# EAGLE design esquematico (EAGLE 8.0.2)
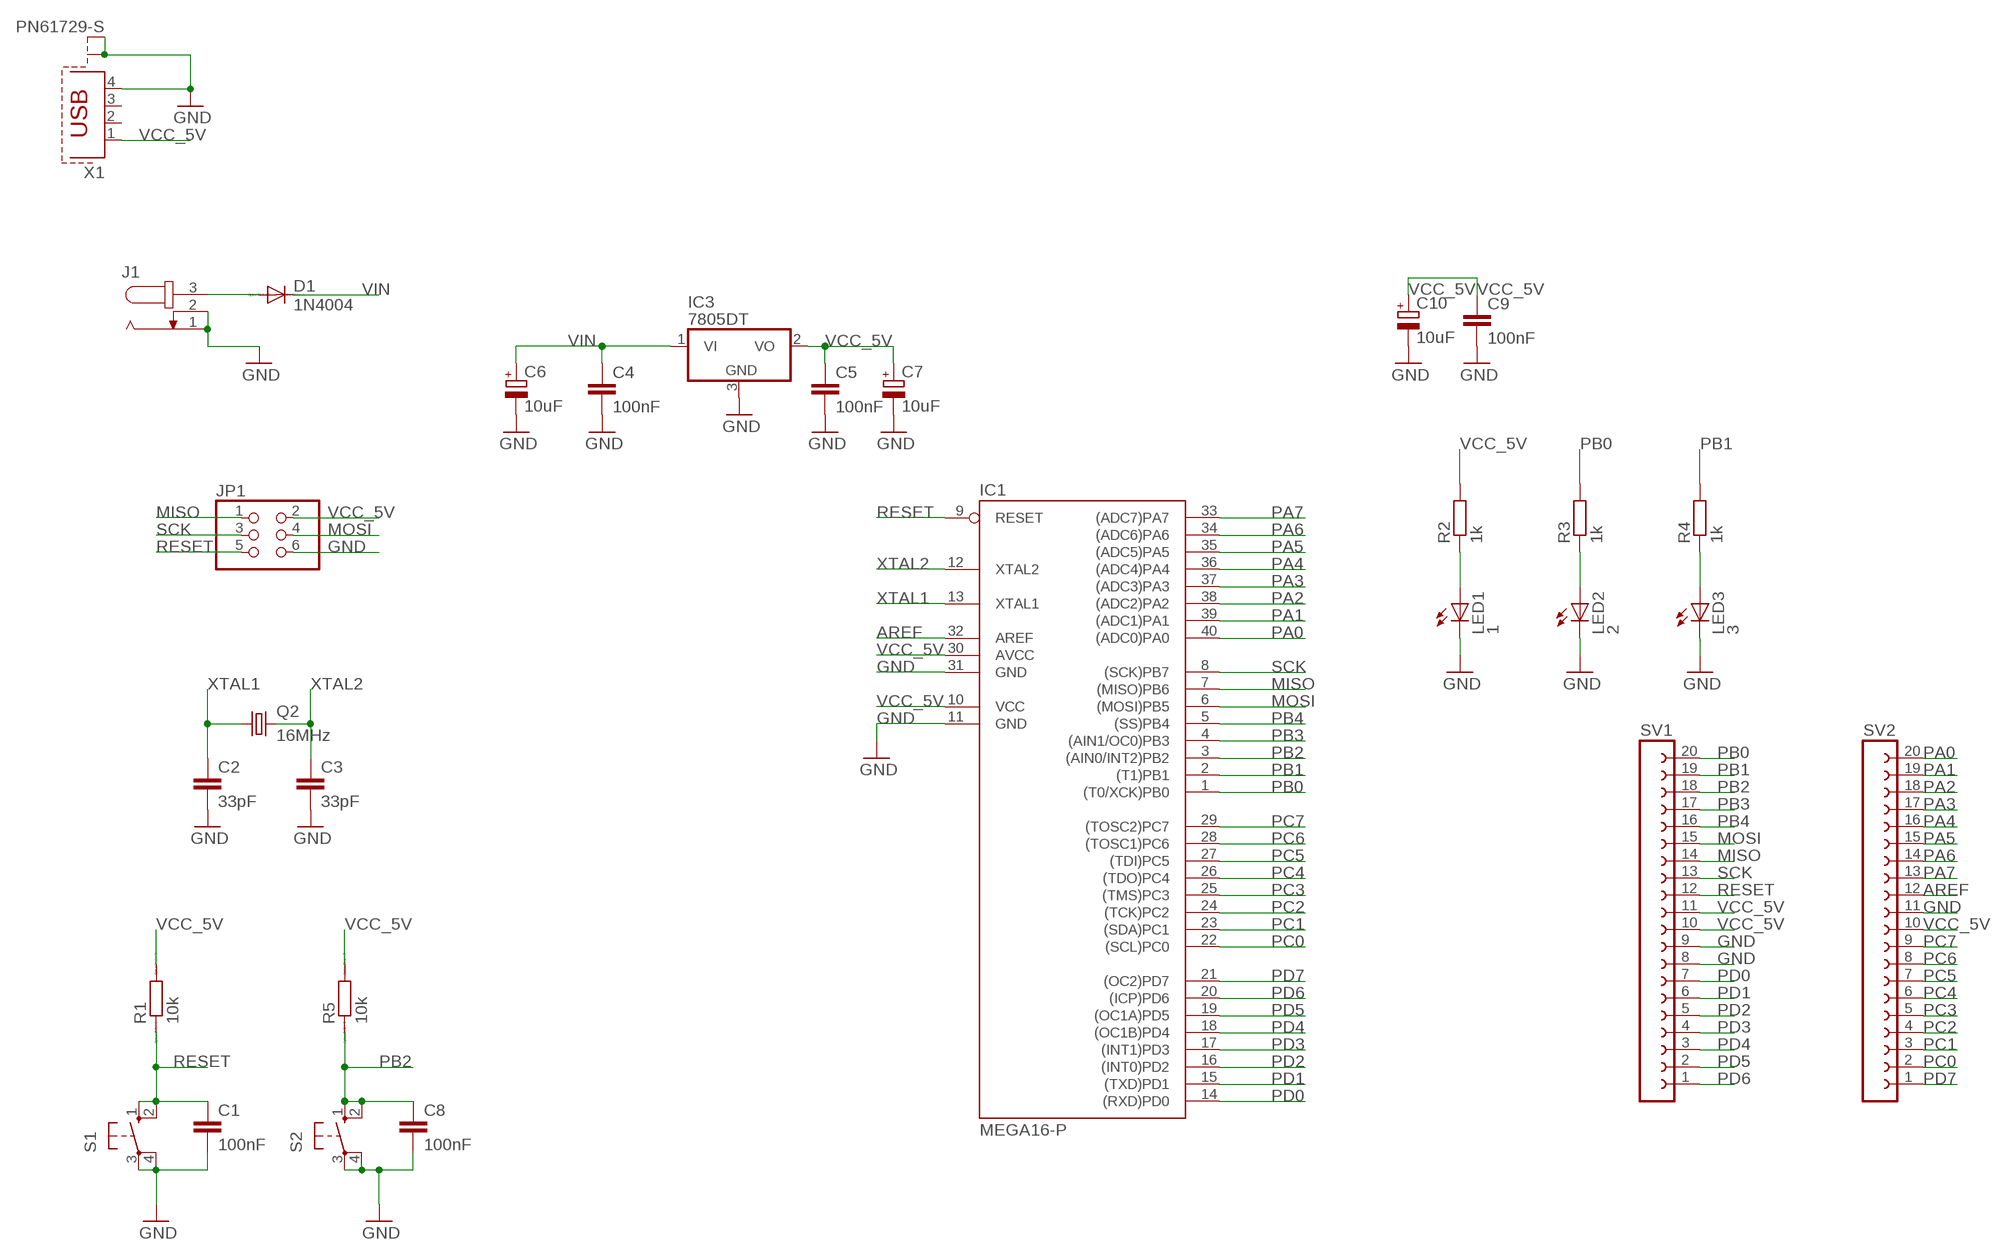
[diagram p0: schematic, sheet 1]

## Parts
C1  100nF  C-EUC1206  [C1206]
C2  33pF  C-EUC1206  [C1206]
C3  33pF  C-EUC1206  [C1206]
C4  100nF  C-EUC1206  [C1206]
C5  100nF  C-EUC1206  [C1206]
C6  10uF  CPOL-EUE2,5-6E  [E2,5-6E]
C7  10uF  CPOL-EUE2,5-6E  [E2,5-6E]
C8  100nF  C-EUC1206  [C1206]
C9  100nF  C-EUC1206  [C1206]
C10  10uF  CPOL-EUE2,5-6E  [E2,5-6E]
D1  1N4004  [DO41-10]
IC1  MEGA16-P  [DIL40]
IC3  7805DT  [TO252]
J1  JACK-PLUG1  [SPC4078]
JP1  PINHD-2X3  [2X03]
LED1  1  LED3MM  [LED3MM]
LED2  2  LED3MM  [LED3MM]
LED3  3  LED3MM  [LED3MM]
Q2  16MHz  CRYSTALHC49S  [HC49/S]
R1  10k  RR1206  [R1206]
R2  1k  R-EU_R1206  [R1206]
R3  1k  R-EU_R1206  [R1206]
R4  1k  R-EU_R1206  [R1206]
R5  10k  RR1206  [R1206]
S1  10-XX  [B3F-10XX]
S2  10-XX  [B3F-10XX]
SV1  FE20-1  [FE20]
SV2  FE20-1  [FE20]
X1  PN61729-S  [PN61729-S]

## Nets
AREF: IC1.32(AREF) SV2.12
GND: C1.2 C2.2 C3.2 C4.2 C5.2 C6.- C7.- C8.2 C9.2 C10.- IC1.11(GND) IC1.31(GND) IC3.3(GND) J1.1 J1.2 JP1.6 LED1.K(C) LED2.K(C) LED3.K(C) S1.3(P) S1.4(P1) S2.3(P) S2.4(P1) SV1.8 SV1.9 SV2.11 X1.4 X1.S1 X1.S2
MISO: IC1.7((MISO)PB6) JP1.1 SV1.14
MOSI: IC1.6((MOSI)PB5) JP1.4 SV1.15
N$1: LED1.A R2.1
N$2: LED2.A R3.1
N$3: LED3.A R4.1
N$6: D1.A J1.3
PA0: IC1.40((ADC0)PA0) SV2.20
PA1: IC1.39((ADC1)PA1) SV2.19
PA2: IC1.38((ADC2)PA2) SV2.18
PA3: IC1.37((ADC3)PA3) SV2.17
PA4: IC1.36((ADC4)PA4) SV2.16
PA5: IC1.35((ADC5)PA5) SV2.15
PA6: IC1.34((ADC6)PA6) SV2.14
PA7: IC1.33((ADC7)PA7) SV2.13
PB0: IC1.1((T0/XCK)PB0) R3.2 SV1.20
PB1: IC1.2((T1)PB1) R4.2 SV1.19
PB2: C8.1 IC1.3((AIN0/INT2)PB2) R5.1 S2.1(S) S2.2(S1) SV1.18
PB3: IC1.4((AIN1/OC0)PB3) SV1.17
PB4: IC1.5((SS)PB4) SV1.16
PC0: IC1.22((SCL)PC0) SV2.2
PC1: IC1.23((SDA)PC1) SV2.3
PC2: IC1.24((TCK)PC2) SV2.4
PC3: IC1.25((TMS)PC3) SV2.5
PC4: IC1.26((TDO)PC4) SV2.6
PC5: IC1.27((TDI)PC5) SV2.7
PC6: IC1.28((TOSC1)PC6) SV2.8
PC7: IC1.29((TOSC2)PC7) SV2.9
PD0: IC1.14((RXD)PD0) SV1.7
PD1: IC1.15((TXD)PD1) SV1.6
PD2: IC1.16((INT0)PD2) SV1.5
PD3: IC1.17((INT1)PD3) SV1.4
PD4: IC1.18((OC1B)PD4) SV1.3
PD5: IC1.19((OC1A)PD5) SV1.2
PD6: IC1.20((ICP)PD6) SV1.1
PD7: IC1.21((OC2)PD7) SV2.1
RESET: C1.1 IC1.9(RESET) JP1.5 R1.1 S1.1(S) S1.2(S1) SV1.12
SCK: IC1.8((SCK)PB7) JP1.3 SV1.13
VCC_5V: C5.1 C7.+ C9.1 C10.+ IC1.10(VCC) IC1.30(AVCC) IC3.2(VO) JP1.2 R1.2 R2.2 R5.2 SV1.10 SV1.11 SV2.10 X1.1
VIN: C4.1 C6.+ D1.C IC3.1(VI)
XTAL1: C2.1 IC1.13(XTAL1) Q2.1
XTAL2: C3.1 IC1.12(XTAL2) Q2.2
Unconnected: X1.2 X1.3

## Library data of the parts
C1 C4 C5 C8 C9 = rcl:C-EU: CAPACITOR, European symbol
C2 C3 = resistor:C-EU: CAPACITOR, European symbol
C6 C7 C10 = rcl:CPOL-EU: POLARIZED CAPACITOR, European symbol
D1 = diode:1N4004: DIODE general purpose rectifier, 1 A
IC1 = atmel:MEGA16-P: MICROCONTROLLER 16 Kbytes FLASH 1 kbytes SRAM 512 bytes EEPROM USART 8-channel 10 bit ADC Source: avr.lbr; MPN: ATMEGA16-16PU; OC_FARNELL: 9171142; OC_NEWARK: 01M6885
IC3 = linear:78*: Positive VOLTAGE REGULATOR Source: http://cache.national.com/ds/LM/LM78L05.pdf http://www.fairchildsemi.com/ds/LM/LM7805.pdf
J1 = con-jack:JACK-PLUG: DC POWER JACK Power Jack, DC, Right Angle, Through Hole, Rated 5A at 16VDC, PC Terminals Distributor: Farnell (www.Farnell.de) Drawing: 84N1161.pdf / 84N1162.pdf Manufacturer: SPC Technology (www.spctechnology.com) Type: SPC4077 / SPC 4078; OC_FARNELL: unknown; OC_NEWARK: unknown
JP1 = pinhead:PINHD-2X3: PIN HEADER
LED1-LED3 = led:LED: LED OSRAM: - CHIPLED LG R971, LG N971, LY N971, LG Q971, LY Q971, LO R971, LY R971 LH N974, LH R974 LS Q976, LO Q976, LY Q976 LO Q996 - Hyper CHIPLED LW Q18S LB Q993, LB Q99A, LB R99A - SideLED LS A670, LO A670, LY A670, LG A670, LP A670 LB A673, LV A673, LT A673, LW A673 LH A674 LY A675 LS A676, LA A676, LO A676, LY A676, LW A676 LS A679, LY A679, LG A679 - Hyper Micro SIDELED® LS Y876, LA Y876, LO Y876, LY Y876 LT Y87S - SmartLED LW L88C, LW L88S LB L89C, LB L89S, LG L890 LS L89K, LO L89K, LY L89K LS L896, LA L896, LO L896, LY L896 - TOPLED LS T670, LO T670, LY T670, LG T670, LP T670 LSG T670, LSP T670, LSY T670, LOP T670, LYG T670 LG T671, LOG T671, LSG T671 LB T673, LV T673, LT T673, LW T673 LH T674 LS T676, LA T676, LO T676, LY T676, LB T676, LH T676, LSB T676, LW T676 LB T67C, LV T67C, LT T67C, LS T67K, LO T67K, LY T67K, LW E67C LS E67B, LA E67B, LO E67B, LY E67B, LB E67C, LV E67C, LT E67C LW T67C LS T679, LY T679, LG T679 LS T770, LO T770, LY T770, LG T770, LP T770 LB T773, LV T773, LT T773, LW T773 LH T774 LS E675, LA E675, LY E675, LS T675 LS T776, LA T776, LO T776, LY T776, LB T776 LHGB T686 LT T68C, LB T68C - Hyper Mini TOPLED® LB M676 - Mini TOPLED Santana® LG M470 LS M47K, LO M47K, LY M47K Source: http://www.osram.convergy.de LUXEON: - LUMILED® LXK2-PW12-R00, LXK2-PW12-S00, LXK2-PW14-U00, LXK2-PW14-V00 LXK2-PM12-R00, LXK2-PM12-S00, LXK2-PM14-U00 LXK2-PE12-Q00, LXK2-PE12-R00, LXK2-PE12-S00, LXK2-PE14-T00, LXK2-PE14-U00 LXK2-PB12-K00, LXK2-PB12-L00, LXK2-PB12-M00, LXK2-PB14-N00, LXK2-PB14-P00, LXK2-PB14-Q00 LXK2-PR12-L00, LXK2-PR12-M00, LXK2-PR14-Q00, LXK2-PR14-R00 LXK2-PD12-Q00, LXK2-PD12-R00, LXK2-PD12-S00 LXK2-PH12-R00, LXK2-PH12-S00 LXK2-PL12-P00, LXK2-PL12-Q00, LXK2-PL12-R00 Source: www.luxeon.com KINGBRIGHT: KA-3528ASYC Source: www.kingbright.com
Q2 = crystal:CRYSTAL: CRYSTAL; OC_FARNELL: 1667008; OC_NEWARK: unknown
R1 R5 = eagle-ltspice:R: RESISTOR, European symbol; SPICEMODEL: NONE; SPICEPREFIX: R
R2-R4 = rcl:R-EU_: RESISTOR, European symbol
S1 S2 = switch-omron:10-XX: OMRON SWITCH; MPN: B3F-1000; OC_FARNELL: 176432; OC_NEWARK: 36M3542
SV1 SV2 = con-lsta:FE20-1: FEMALE HEADER; OC_FARNELL: unknown; OC_NEWARK: unknown
X1 = con-berg:PN61729-S: BERG USB connector; OC_FARNELL: unknown; OC_NEWARK: unknown

## Board
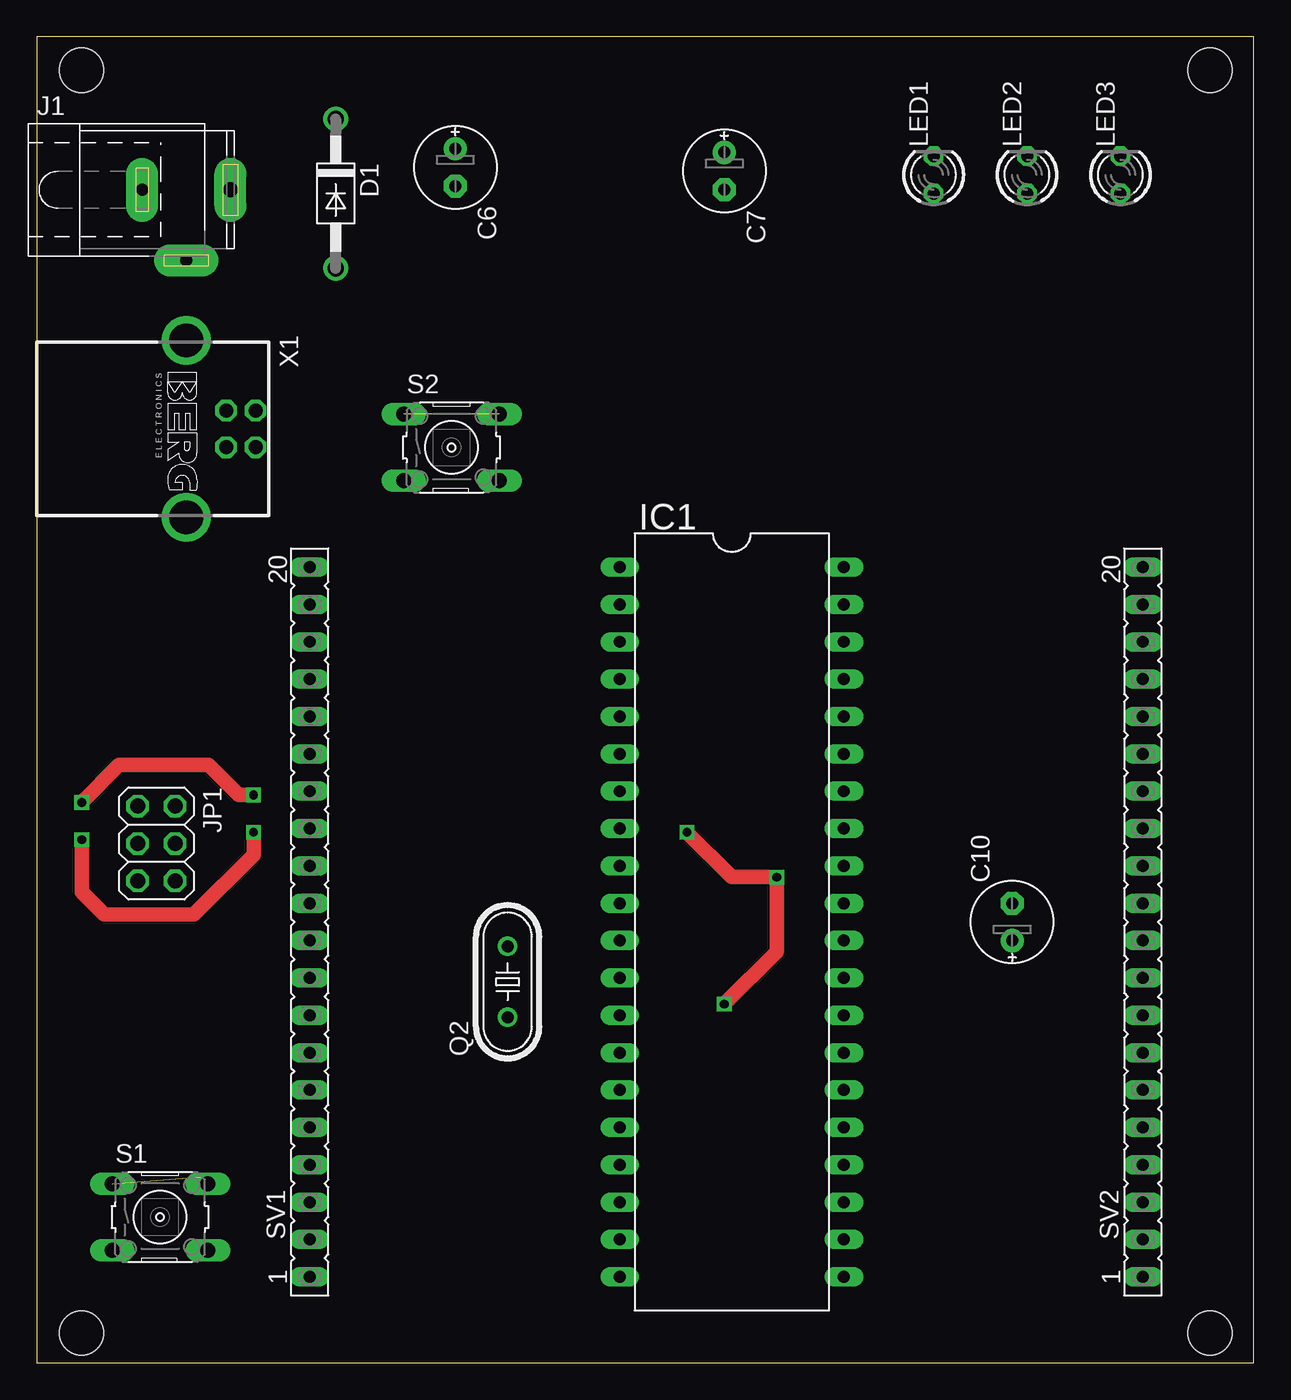
[diagram p1: board, top side]
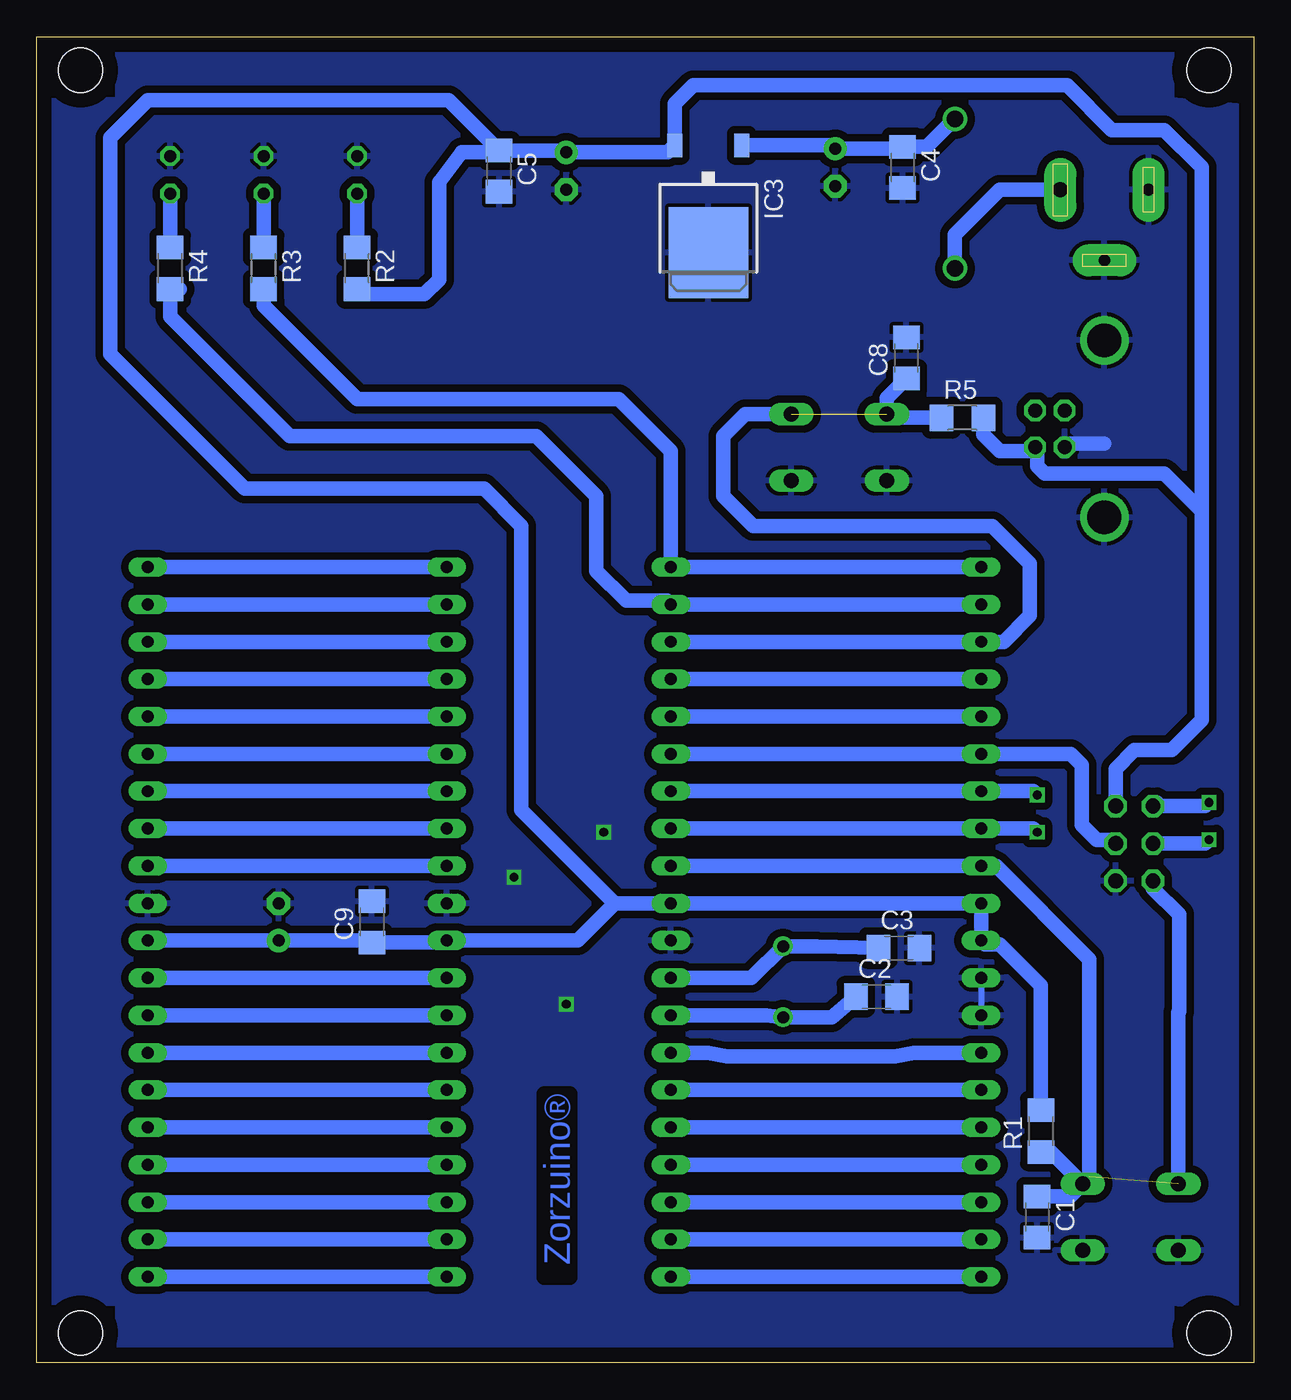
[diagram p2: board, bottom side, seen from below]

Size 82.73 x 90.16 mm. Coordinates in mm from the lower left corner, seen from the top.
Outline: 0,0 82.73,0 82.73,90.16 0,90.16 0,0
Copper layers (1*16): Top 0.035mm / dielectric 1.5mm / Bottom 0.035mm
Design rules "default *": minimum track width 30mil, minimum drill 44mil, track to track 20mil, track to pad 20mil, pad to pad 20mil, via to via 20mil, smd to smd 20mil, copper to edge 40mil, drill to drill 15mil, minimum pad ring 10mil, minimum via ring 8mil, stop-mask expansion 4mil, vias tented up to drill 0mil, thermal gap 10mil
Holes 3 mm at 3.05,87.88 79.76,87.88 3.05,2.03 79.76,2.03

### Footprints (pad centres in the part's own frame; a part is rotated, then mirrored left to right if it is on the bottom)
C1206 = smd 1.6 x 1.8: 1 -1.4,0; 2 1.4,0
E2,5-6E = drill 0.813 pad 1.575: + -1.27,0 | drill 0.813 pad 1.575 octagon: - 1.27,0
DO41-10 = drill 1.118: A 5.08,0; C -5.08,0
DIL40 = drill 0.813 long: 1 -24.13,-7.62; 2 -21.59,-7.62; 3 -19.05,-7.62; 4 -16.51,-7.62; 5 -13.97,-7.62; 6 -11.43,-7.62; 7 -8.89,-7.62; 8 -6.35,-7.62; 9 -3.81,-7.62; 10 -1.27,-7.62; 11 1.27,-7.62; 12 3.81,-7.62; 13 6.35,-7.62; 14 8.89,-7.62; 15 11.43,-7.62; 16 13.97,-7.62; 17 16.51,-7.62; 18 19.05,-7.62; 19 21.59,-7.62; 20 24.13,-7.62; 21 24.13,7.62; 22 21.59,7.62; 23 19.05,7.62; 24 16.51,7.62; 25 13.97,7.62; 26 11.43,7.62; 27 8.89,7.62; 28 6.35,7.62; 29 3.81,7.62; 30 1.27,7.62; 31 -1.27,7.62; 32 -3.81,7.62; 33 -6.35,7.62; 34 -8.89,7.62; 35 -11.43,7.62; 36 -13.97,7.62; 37 -16.51,7.62; 38 -19.05,7.62; 39 -21.59,7.62; 40 -24.13,7.62
TO252 = smd 1 x 1.6: 1 -2.28,-4.8; 2 2.28,-4.8 | smd 5.4 x 6.2: 3 0,2.5
SPC4078 = drill 0.8 pad 2.184 long: 1 -3,0; 2 0,-4.8 | drill 1 pad 2.184 long: 3 3,0
2X03 = drill 1.016 octagon: 1 -2.54,-1.27; 2 -2.54,1.27; 3 0,-1.27; 4 0,1.27; 5 2.54,-1.27; 6 2.54,1.27
LED3MM = drill 0.813 octagon: A -1.27,0; K 1.27,0
HC49/S = drill 0.813: 1 -2.413,0; 2 2.413,0
R1206 = smd 1.6 x 1.803: 1 -1.422,0; 2 1.422,0
B3F-10XX = drill 1.016 long: 1 -3.251,2.261; 2 3.251,2.261; 3 -3.251,-2.261; 4 3.251,-2.261
FE20 = drill 0.813 long: 1 -24.13,0; 2 -21.59,0; 3 -19.05,0; 4 -16.51,0; 5 -13.97,0; 6 -11.43,0; 7 -8.89,0; 8 -6.35,0; 9 -3.81,0; 10 -1.27,0; 11 1.27,0; 12 3.81,0; 13 6.35,0; 14 8.89,0; 15 11.43,0; 16 13.97,0; 17 16.51,0; 18 19.05,0; 19 21.59,0; 20 24.13,0
PN61729-S = drill 0.95 octagon: 1 1.25,4.71; 2 -1.25,4.71; 3 -1.25,2.71; 4 1.25,2.71 | drill 2.3 pad 2.9: S1 -6.02,0; S2 6.02,0

### Placement (x,y rotation side)
C1  14.73,9.91 270 bottom
C2  25.65,24.89 0 bottom
C3  24.13,28.19 0 bottom
C4  23.88,81.28 270 bottom
C5  51.31,81.03 270 bottom
C6  28.45,81.28 270 top
C7  46.74,81.03 270 top
C8  23.62,68.33 90 bottom
C9  59.94,29.97 90 bottom
C10  66.29,29.97 90 top
D1  20.32,79.5 270 top
IC1  47.24,29.97 270 top
IC3  37.08,77.98 180 bottom
J1  10.16,79.76 0 top
JP1  8.13,35.31 270 top
LED1  60.96,80.77 90 top
LED2  67.31,80.77 90 top
LED3  73.66,80.77 90 top
Q2  32,25.91 90 top
R1  14.48,15.75 90 bottom
R2  60.96,74.42 270 bottom
R3  67.31,74.42 270 bottom
R4  73.66,74.42 270 bottom
R5  19.81,64.26 0 bottom
S1  8.38,9.91 0 top
S2  28.19,62.23 0 top
SV1  18.54,29.97 90 top
SV2  75.18,29.97 90 top
X1  10.16,63.5 270 top

### Tracks (layer width: path | path; a pad name or v marks a point on that pad's centre or on a via)
AREF
  Bottom 1: IC1.32 SV2.12
GND  (via drill 0.6)
  Top 1: v44.2,36.07 47.24,33.02 v50.29,33.02 50.29,27.94 v46.74,24.38
  Bottom 0.406: SV1.9 SV1.8 | IC1.31 54.99,31.37 | C9.2 60.07,31.24
  Bottom 1: X1.4 12.64,62.48 10.16,62.48
  pour Bottom: 0,85.34 5.59,85.85 5.59,90.42 77.22,90.42 77.22,85.85 82.8,85.85 82.8,4.06 77.22,4.06 77.22,0 5.59,0 5.59,4.06 0,3.56
MISO  (via drill 0.6)
  Top 1: v3.05,38.1 5.59,40.64 11.68,40.64 13.72,38.61 v14.73,38.61
  Bottom 1: IC1.7 SV1.14 14.99,38.86 v14.73,38.61 | 6.6,38.1 JP1.1 3.3,37.85 v3.05,38.1
MOSI
  Bottom 1: IC1.6 SV1.15 12.45,41.4 11.68,40.64 11.68,36.58 10.67,35.56 9.65,35.56 JP1.4
N$1
  Bottom 1: LED1.A R2.1
N$2
  Bottom 1: LED2.A R3.1
N$3
  Bottom 1: LED3.A R4.1
N$6
  Bottom 1: J1.3 17.27,79.76 20.32,76.71 D1.A
PA0
  Bottom 1: IC1.40 SV2.20
PA1
  Bottom 1: IC1.39 SV2.19
PA2
  Bottom 1: IC1.38 SV2.18
PA3
  Bottom 1: IC1.37 SV2.17
PA4
  Bottom 1: IC1.36 SV2.16
PA5
  Bottom 1: IC1.35 SV2.15
PA6
  Bottom 1: IC1.34 SV2.14
PA7
  Bottom 1: IC1.33 SV2.13
PB0
  Bottom 1: SV1.20 IC1.1 39.62,61.98 43.18,65.53 50.29,65.53 | R3.2 67.31,71.88 60.96,65.53 50.29,65.53 | 50.29,65.53 49.78,65.53
PB1
  Bottom 1: SV1.19 IC1.2 39.88,51.82 42.67,51.82 44.7,53.85 44.7,58.93 48.77,62.99 65.53,62.99 73.66,71.12 R4.2 73,73
PB2  (1 unrouted)
  Bottom 1: IC1.3 SV1.18 17.02,49.02 15.24,50.8 15.24,54.36 17.78,56.9 34.04,56.9 36.07,58.93 36.07,62.99 34.57,64.49 S2.2 | 21.51,63.98 R5.1 24.71,64.26 S2.1 24.94,65.61 C8.1
PB3
  Bottom 1: SV1.17 IC1.4
PB4
  Bottom 1: SV1.16 IC1.5
PC0
  Bottom 1: IC1.22 SV2.2
PC1
  Bottom 1: IC1.23 SV2.3
PC2
  Bottom 1: IC1.24 SV2.4
PC3
  Bottom 1: IC1.25 SV2.5
PC4
  Bottom 1: IC1.26 SV2.6
PC5
  Bottom 1: IC1.27 SV2.7
PC6
  Bottom 1: IC1.28 SV2.8
PC7
  Bottom 1: IC1.29 SV2.9
PD0
  Bottom 1: SV1.7 23.11,21.08 24.38,20.83 35.81,20.83 37.08,21.08 IC1.14
PD1
  Bottom 1: SV1.6 IC1.15
PD2
  Bottom 1: SV1.5 IC1.16
PD3
  Bottom 1: SV1.4 IC1.17
PD4
  Bottom 1: SV1.3 IC1.18
PD5
  Bottom 1: SV1.2 IC1.19
PD6
  Bottom 1: SV1.1 IC1.20
PD7
  Bottom 1: IC1.21 SV2.1
RESET  (1 unrouted)
  Bottom 1: IC1.9 SV1.12 17.53,33.78 11.18,27.43 11.18,12.62 S1.2 | S1.2 12.49,11.31 C1.1 | S1.2 13.79,14.33 R1.1 | S1.1 5.13,23.82 5.08,23.88 5.08,30.48 6.86,32.26 JP1.5
SCK  (via drill 0.6)
  Top 1: v3.05,35.56 3.05,32 4.57,30.48 10.67,30.48 14.73,34.54 v14.73,36.07
  Bottom 0.254: 18.03,36.32 SV1.13
  Bottom 1: IC1.8 SV1.13 14.99,36.32 v14.73,36.07 | v3.05,35.56 3.3,35.31 JP1.3
VCC_5V
  Bottom 0.406: IC1.30 54.99,28.57 | C9.1 60.07,28.7
  Bottom 1: 54.99,28.57 C9.1 | 60.07,28.7 C10.+ SV2.10 | 43.43,31.24 IC1.10 SV1.11 SV1.10 18.29,28.45 17.27,28.45 14.48,25.65 R1.2 | 43.43,31.24 45.97,28.7 IC1.30 | C7.+ 46.23,82.3 | C7.+ 46.87,82.43 C5.1 | C5.1 51.44,82.3 53.85,82.3 55.37,80.26 55.37,73.66 56.39,72.64 60.6,72.64 R2.2 | C5.1 54.73,85.85 75.18,85.85 77.72,83.31 77.72,68.58 68.58,59.44 52.32,59.44 49.78,56.9 49.78,37.59 43.43,31.24 | JP1.2 9.4,40.39 8.13,41.66 5.59,41.66 3.56,43.69 3.56,57.4 | C7.+ 39.85,82.3 IC3.2 39.36,85.6 38.1,86.87 12.7,86.87 9.65,83.82 6.1,83.82 3.56,81.28 3.56,60.45 3.56,59.94 3.56,57.4 | R5.2 18.39,63.09 17.27,61.98 15.14,61.98 X1.1 14.73,62.11 14.73,60.96 14.22,60.45 6.1,60.45 3.56,57.91 3.56,57.4
VIN
  Bottom 1: D1.C 22.22,82.68 C4.1 24.01,82.55 C6.+ 28.68,82.78 IC3.1
XTAL1
  Bottom 1: IC1.13 33.15,23.62 Q2.1 28.71,23.5 C2.1
XTAL2
  Bottom 1: IC1.12 34.16,26.16 Q2.2 29.72,28.32 C3.1

### Text on the board
Bottom: Zorzuino®